# EAGLE board EEGFrontOnly (EAGLE 8.6.0), part 1 of 2
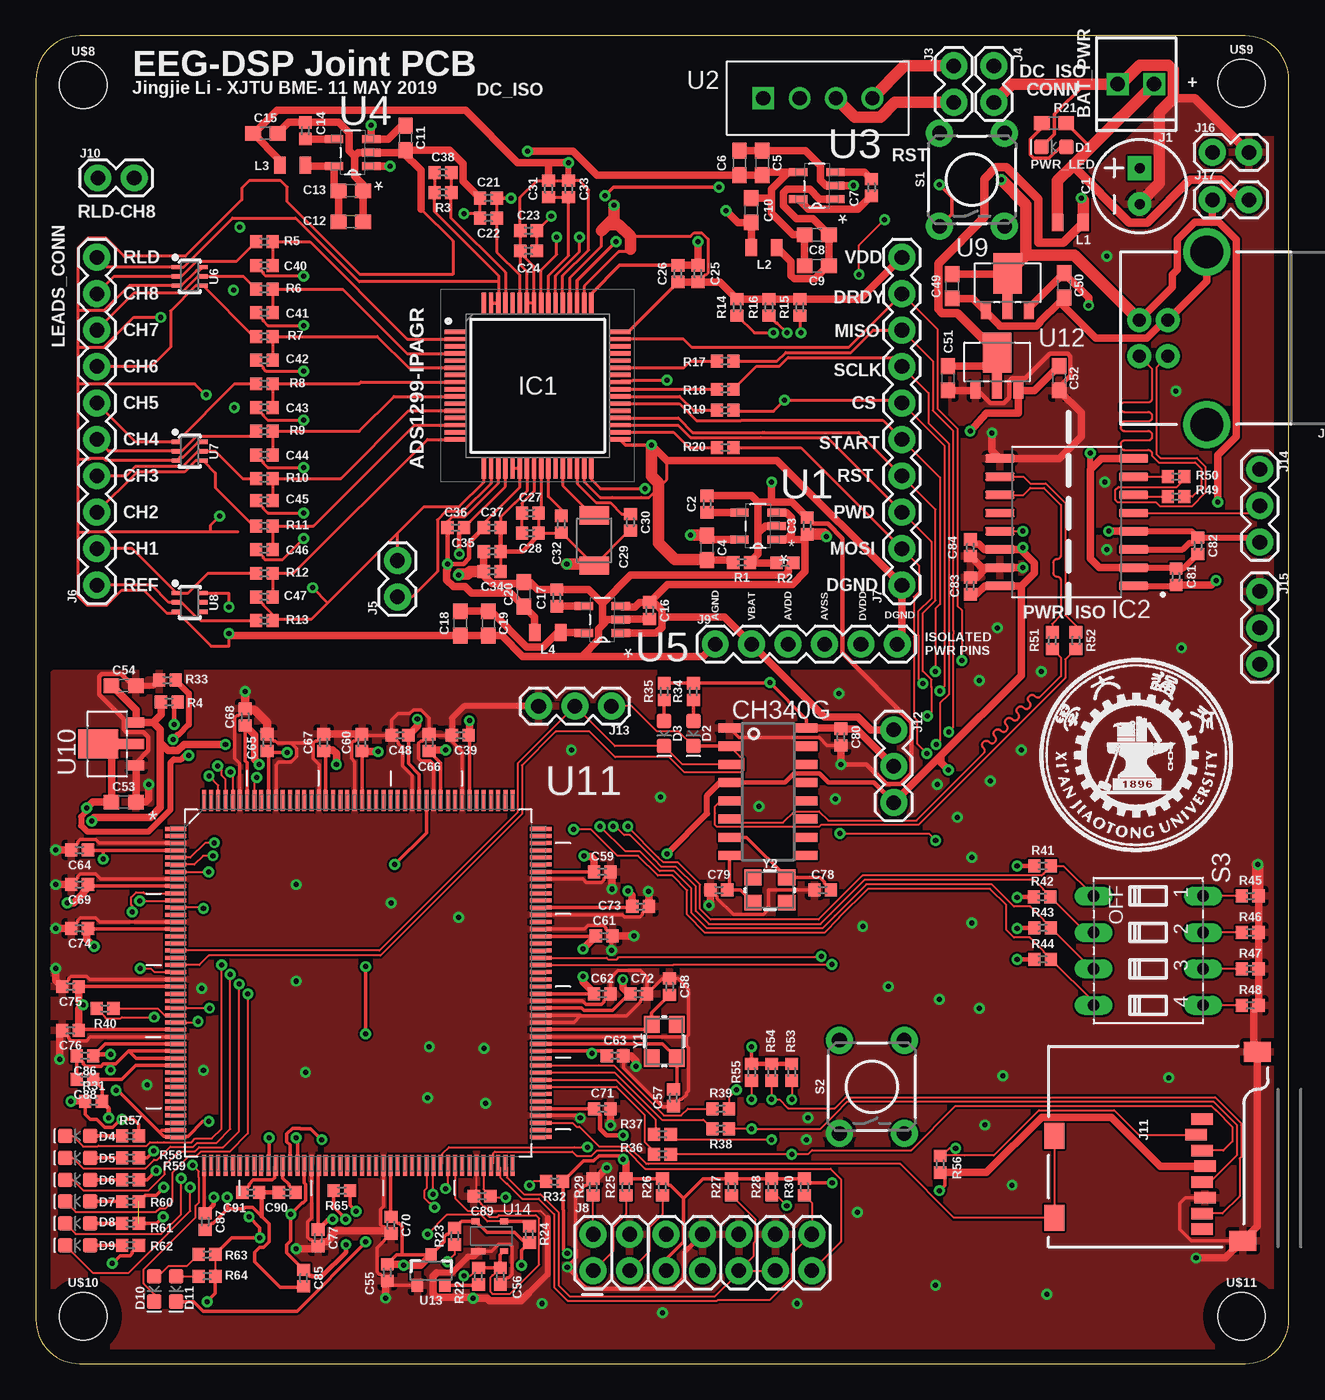
[diagram p4: board, top side]
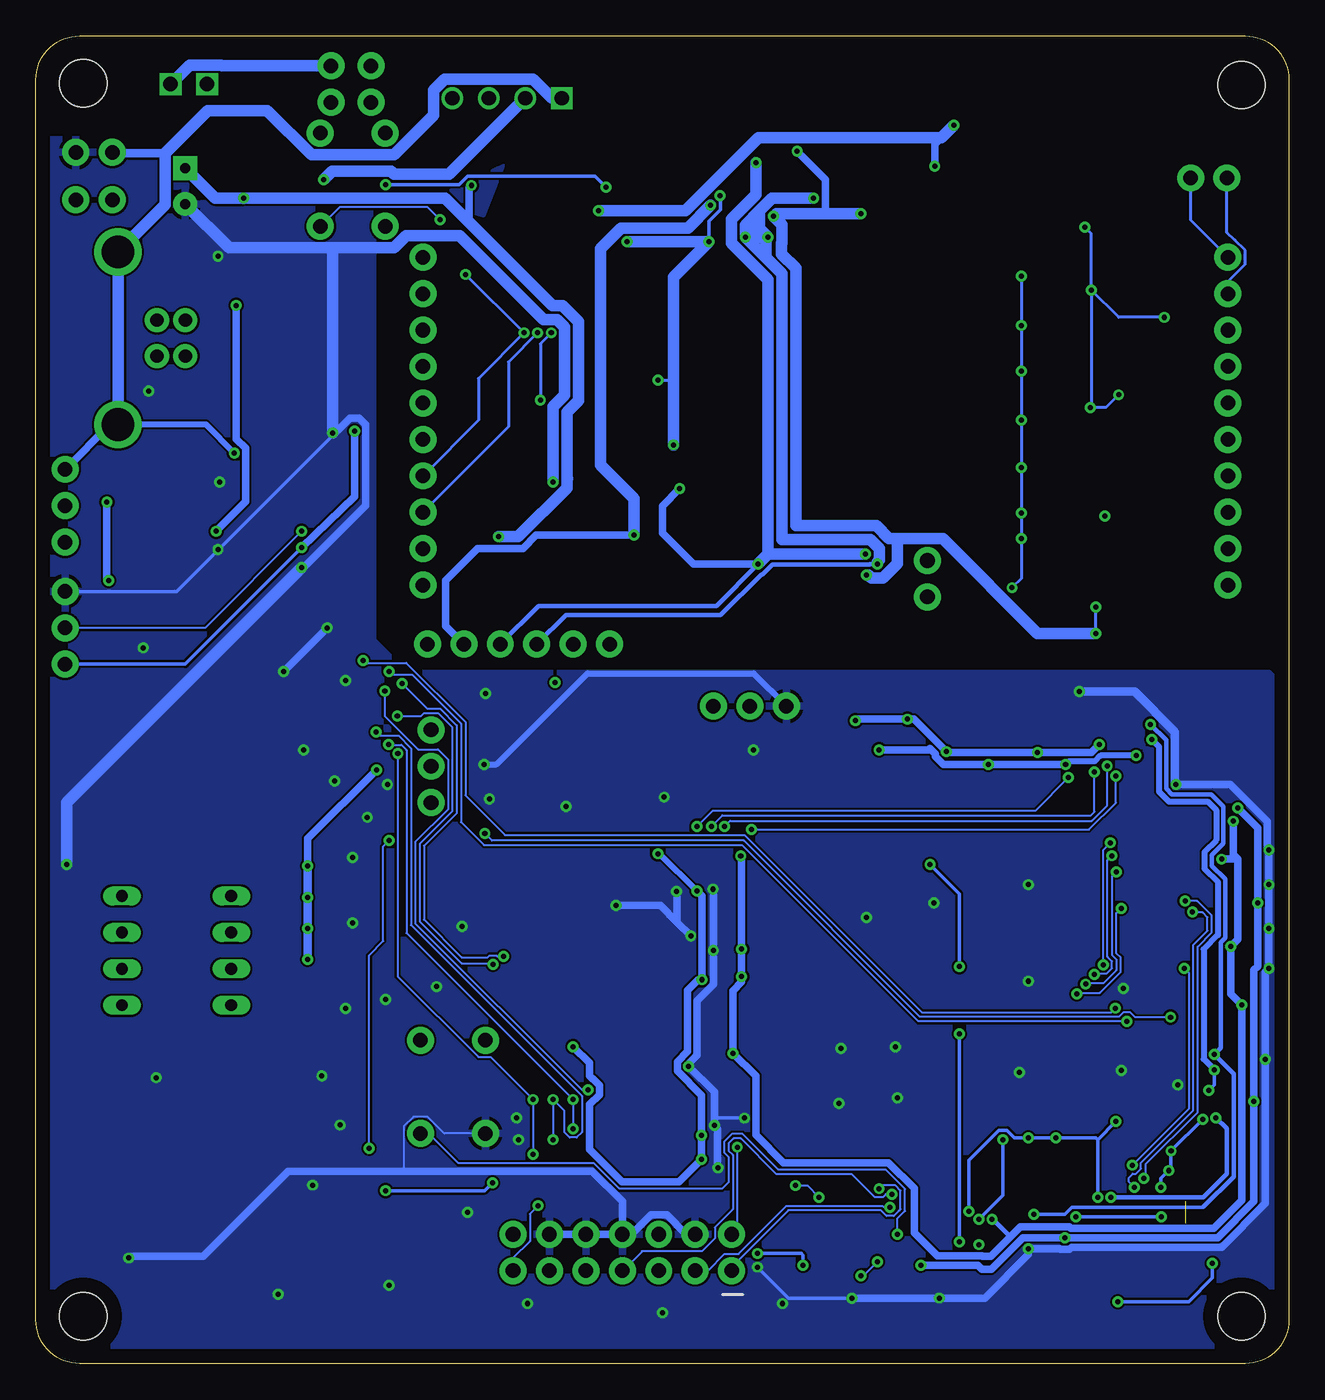
[diagram p5: board, bottom side, seen from below]

Size 87.38 x 92.58 mm. Coordinates in mm from the lower left corner, seen from the top.
Outline: 87.38,3.05 87.38,89.53 arc90 84.33,92.58 3.05,92.58 arc90 0,89.53 0,3.05 arc90 3.05,0 84.33,0 arc90 87.38,3.05
Copper layers (1*16): Top 0.035mm / dielectric 1.53mm / Bottom 0.035mm
Design rules "default *": minimum track width 6mil, minimum drill 0.35mm, track to track 6mil, track to pad 6mil, pad to pad 6mil, via to via 6mil, smd to smd 6mil, copper to edge 40mil, drill to drill 6mil, minimum pad ring 10mil, minimum via ring 8mil, stop-mask expansion 4mil, vias tented up to drill 0mil, thermal gap 10mil

## Footprints (pad centres in the part's own frame; a part is rotated, then mirrored left to right if it is on the bottom)
CPOL-RADIAL-2.5MM-6.5MM = drill 0.7 pad 1.651 square: 1 1.25,0 | drill 0.7 pad 1.651: 2 -1.25,0
0402 = smd 0.85 x 0.9: 1 -0.58,0; 2 0.58,0
0603 = smd 1.1 x 1: 1 -0.85,0; 2 0.85,0
1210 = smd 1.27 x 2.06: 1 -1.755,0; 2 1.755,0
LED-0603 = smd 1 x 1: A -0.877,0; C 0.877,0
QFP50P1200X1200X120-64N = smd 1.475 x 0.3: 1 -5.738,3.75; 2 -5.738,3.25; 3 -5.738,2.75; 4 -5.738,2.25; 5 -5.738,1.75; 6 -5.738,1.25; 7 -5.738,0.75; 8 -5.738,0.25; 9 -5.738,-0.25; 10 -5.738,-0.75; 11 -5.738,-1.25; 12 -5.738,-1.75; 13 -5.738,-2.25; 14 -5.738,-2.75; 15 -5.738,-3.25; 16 -5.738,-3.75; 33 5.738,-3.75; 34 5.738,-3.25; 35 5.738,-2.75; 36 5.738,-2.25; 37 5.738,-1.75; 38 5.738,-1.25; 39 5.738,-0.75; 40 5.738,-0.25; 41 5.738,0.25; 42 5.738,0.75; 43 5.738,1.25; 44 5.738,1.75; 45 5.738,2.25; 46 5.738,2.75; 47 5.738,3.25; 48 5.738,3.75 | smd 0.3 x 1.475: 17 -3.75,-5.738; 18 -3.25,-5.738; 19 -2.75,-5.738; 20 -2.25,-5.738; 21 -1.75,-5.738; 22 -1.25,-5.738; 23 -0.75,-5.738; 24 -0.25,-5.738; 25 0.25,-5.738; 26 0.75,-5.738; 27 1.25,-5.738; 28 1.75,-5.738; 29 2.25,-5.738; 30 2.75,-5.738; 31 3.25,-5.738; 32 3.75,-5.738; 49 3.75,5.738; 50 3.25,5.738; 51 2.75,5.738; 52 2.25,5.738; 53 1.75,5.738; 54 1.25,5.738; 55 0.75,5.738; 56 0.25,5.738; 57 -0.25,5.738; 58 -0.75,5.738; 59 -1.25,5.738; 60 -1.75,5.738; 61 -2.25,5.738; 62 -2.75,5.738; 63 -3.25,5.738; 64 -3.75,5.738
SOIC127P1032X265-16N = smd 2.05 x 0.6: 1 -4.655,4.445; 2 -4.655,3.175; 3 -4.655,1.905; 4 -4.655,0.635; 5 -4.655,-0.635; 6 -4.655,-1.905; 7 -4.655,-3.175; 8 -4.655,-4.445; 9 4.655,-4.445; 10 4.655,-3.175; 11 4.655,-1.905; 12 4.655,-0.635; 13 4.655,0.635; 14 4.655,1.905; 15 4.655,3.175; 16 4.655,4.445
1X02_2.54_SCREWTERM = drill 1.016 square: P1 2.54,0; P2 0,0
USB-B-PTH = drill 0.914 pad 1.676: D+ 4,1.25; D- 5.981,1.25; GND 4,-1.25; VBUS 5.981,-1.25 | drill 2.286: SHLD1 1.282,-6.02; SHLD2 1.282,6.02
1X02 = drill 1.016 pad 1.88: 1 0,0; 2 2.54,0
1X10 = drill 1.016 pad 1.88: 1 0,0; 2 2.54,0; 3 5.08,0; 4 7.62,0; 5 10.16,0; 6 12.7,0; 7 15.24,0; 8 17.78,0; 9 20.32,0; 10 22.86,0
2X7 = drill 1.016 pad 1.88: 1 0,0; 2 0,2.54; 3 2.54,0; 4 2.54,2.54; 5 5.08,0; 6 5.08,2.54; 7 7.62,0; 8 7.62,2.54; 9 10.16,0; 10 10.16,2.54; 11 12.7,0; 12 12.7,2.54; 13 15.24,0; 14 15.24,2.54
1X06 = drill 1.016 pad 1.88: 1 0,0; 2 2.54,0; 3 5.08,0; 4 7.62,0; 5 10.16,0; 6 12.7,0
MICRO-SD-SOCKET = smd 1.8 x 1.4: CD1 -2.05,0.4; CD2 -7.75,0.4 | smd 0.8 x 1.5: CS -7.84,10.3; DI -6.74,10.7; DO -2.34,10.7; GND -3.44,10.9; RSV1 -8.94,10.7; RSV2 -1.24,10.7; SCLK -4.54,10.7; VCC -5.64,10.9 | smd 1.4 x 1.9: GND1 -13.6,14.55; GND3 -0.45,13.55
1X03 = drill 1.016 pad 1.88: 1 0,0; 2 2.54,0; 3 5.08,0
0805 = smd 0.8 x 1.2: 1 -0.9,0; 2 0.9,0
TACTILE_SWITCH_PTH_6.0MM = drill 1.016 pad 1.88: 1 -3.251,2.261; 2 3.251,2.261; 3 -3.251,-2.261; 4 3.251,-2.261
DIP04S = drill 0.813 long: 1 -3.81,-3.81; 2 -1.27,-3.81; 3 1.27,-3.81; 4 3.81,-3.81; 5 3.81,3.81; 6 1.27,3.81; 7 -1.27,3.81; 8 -3.81,3.81
SOT95P280X145-5N = smd 1.27 x 0.559: 1 -1.295,0.94; 2 -1.295,0; 3 -1.295,-0.94; 4 1.295,-0.94; 5 1.295,0.94
DIP4 = drill 1 square: 1 0,0 | drill 1: 2 2.54,0; 3 5.08,0; 4 7.62,0
SC70-6 = smd 0.3 x 0.66: 1 -0.65,-0.92; 2 0,-0.92; 3 0.65,-0.92; 4 0.65,0.92; 5 0,0.92; 6 -0.65,0.92
SOT-89 = smd 0.7 x 1.1: 1 1.5,-2.385; 2 -1.5,-2.385 | smd 0.7 x 1.8: 3 0,-2.035 | smd 2 x 2.8: 4 0,0.265
QFP50P2600X2600X160-176N = smd 1.473 x 0.279: 1 -12.725,10.744; 2 -12.725,10.262; 3 -12.725,9.754; 4 -12.725,9.246; 5 -12.725,8.738; 6 -12.725,8.255; 7 -12.725,7.747; 8 -12.725,7.239; 9 -12.725,6.756; 10 -12.725,6.248; 11 -12.725,5.74; 12 -12.725,5.258; 13 -12.725,4.75; 14 -12.725,4.242; 15 -12.725,3.759; 16 -12.725,3.251; 17 -12.725,2.743; 18 -12.725,2.261; 19 -12.725,1.753; 20 -12.725,1.245; 21 -12.725,0.762; 22 -12.725,0.254; 23 -12.725,-0.254; 24 -12.725,-0.762; 25 -12.725,-1.245; 26 -12.725,-1.753; 27 -12.725,-2.261; 28 -12.725,-2.743; 29 -12.725,-3.251; 30 -12.725,-3.759; 31 -12.725,-4.242; 32 -12.725,-4.75; 33 -12.725,-5.258; 34 -12.725,-5.74; 35 -12.725,-6.248; 36 -12.725,-6.756; 37 -12.725,-7.239; 38 -12.725,-7.747; 39 -12.725,-8.255; 40 -12.725,-8.738; 41 -12.725,-9.246; 42 -12.725,-9.754; 43 -12.725,-10.262; 44 -12.725,-10.744; 89 12.725,-10.744; 90 12.725,-10.262; 91 12.725,-9.754; 92 12.725,-9.246; 93 12.725,-8.738; 94 12.725,-8.255; 95 12.725,-7.747; 96 12.725,-7.239; 97 12.725,-6.756; 98 12.725,-6.248; 99 12.725,-5.74; 100 12.725,-5.258; 101 12.725,-4.75; 102 12.725,-4.242; 103 12.725,-3.759; 104 12.725,-3.251; 105 12.725,-2.743; 106 12.725,-2.261; 107 12.725,-1.753; 108 12.725,-1.245; 109 12.725,-0.762; 110 12.725,-0.254; 111 12.725,0.254; 112 12.725,0.762; 113 12.725,1.245; 114 12.725,1.753; 115 12.725,2.261; 116 12.725,2.743; 117 12.725,3.251; 118 12.725,3.759; 119 12.725,4.242; 120 12.725,4.75; 121 12.725,5.258; 122 12.725,5.74; 123 12.725,6.248; 124 12.725,6.756; 125 12.725,7.239; 126 12.725,7.747; 127 12.725,8.255; 128 12.725,8.738; 129 12.725,9.246; 130 12.725,9.754; 131 12.725,10.262; 132 12.725,10.744 | smd 0.279 x 1.473: 45 -10.744,-12.725; 46 -10.262,-12.725; 47 -9.754,-12.725; 48 -9.246,-12.725; 49 -8.738,-12.725; 50 -8.255,-12.725; 51 -7.747,-12.725; 52 -7.239,-12.725; 53 -6.756,-12.725; 54 -6.248,-12.725; 55 -5.74,-12.725; 56 -5.258,-12.725; 57 -4.75,-12.725; 58 -4.242,-12.725; 59 -3.759,-12.725; 60 -3.251,-12.725; 61 -2.743,-12.725; 62 -2.261,-12.725; 63 -1.753,-12.725; 64 -1.245,-12.725; 65 -0.762,-12.725; 66 -0.254,-12.725; 67 0.254,-12.725; 68 0.762,-12.725; 69 1.245,-12.725; 70 1.753,-12.725; 71 2.261,-12.725; 72 2.743,-12.725; 73 3.251,-12.725; 74 3.759,-12.725; 75 4.242,-12.725; 76 4.75,-12.725; 77 5.258,-12.725; 78 5.74,-12.725; 79 6.248,-12.725; 80 6.756,-12.725; 81 7.239,-12.725; 82 7.747,-12.725; 83 8.255,-12.725; 84 8.738,-12.725; 85 9.246,-12.725; 86 9.754,-12.725; 87 10.262,-12.725; 88 10.744,-12.725; 133 10.744,12.725; 134 10.262,12.725; 135 9.754,12.725; 136 9.246,12.725; 137 8.738,12.725; 138 8.255,12.725; 139 7.747,12.725; 140 7.239,12.725; 141 6.756,12.725; 142 6.248,12.725; 143 5.74,12.725; 144 5.258,12.725; 145 4.75,12.725; 146 4.242,12.725; 147 3.759,12.725; 148 3.251,12.725; 149 2.743,12.725; 150 2.261,12.725; 151 1.753,12.725; 152 1.245,12.725; 153 0.762,12.725; 154 0.254,12.725; 155 -0.254,12.725; 156 -0.762,12.725; 157 -1.245,12.725; 158 -1.753,12.725; 159 -2.261,12.725; 160 -2.743,12.725; 161 -3.251,12.725; 162 -3.759,12.725; 163 -4.242,12.725; 164 -4.75,12.725; 165 -5.258,12.725; 166 -5.74,12.725; 167 -6.248,12.725; 168 -6.756,12.725; 169 -7.239,12.725; 170 -7.747,12.725; 171 -8.255,12.725; 172 -8.738,12.725; 173 -9.246,12.725; 174 -9.754,12.725; 175 -10.262,12.725; 176 -10.744,12.725
SOT23-3 = smd 0.8 x 0.9: 1 -0.95,-1; 2 0.95,-1; 3 0,1.1
SOT143 = smd 1 x 0.42: 1 -0.89,-1.045 | smd 0.56 x 0.41: 2 0.91,-1.04; 3 0.911,1.028; 4 -1.079,1.041
SOIC16 = smd 0.635 x 1.524: 1 -4.445,-2.695; 2 -3.175,-2.695; 3 -1.905,-2.695; 4 -0.635,-2.695; 5 0.635,-2.695; 6 1.905,-2.695; 7 3.175,-2.695; 8 4.445,-2.695; 9 4.445,2.695; 10 3.175,2.695; 11 1.905,2.695; 12 0.635,2.695; 13 -0.635,2.695; 14 -1.905,2.695; 15 -3.175,2.695; 16 -4.445,2.695
STAND-OFF = hole 3.302: 0,0
CRYSTAL-SMD-3.2X2.5MM = smd 1.2 x 1.1: 1 -1.175,-0.875; 2 1.175,-0.875; 3 1.175,0.875; 4 -1.175,0.875

## Placement (x,y rotation side)
C1  100uF  [CPOL-RADIAL-2.5MM-6.5MM]  76.96,82.11 90 top
C2  10nF  [0402]  46.8,59.94 90 top
C3  1.0uF  [0402]  53.78,58.41 90 top
C4  2.2uF  [0603]  46.8,56.89 270 top
C5  10uF  [0603]  50.65,83.72 270 top
C6  1.0uF  [0603]  49.06,83.72 270 top
C7  1.0uF  [0402]  58.27,82.01 90 top
C8  10uF  [0603]  54.46,78.7 180 top
C9  1.0uF  [0603]  54.46,76.55 180 top
C10  10uF  [0603]  49.88,80.42 90 top
C11  2.2uF  [0603]  25.78,85.46 270 top
C12  2.2uF  [0603]  21.97,79.62 0 top
C13  10uF  [0603]  21.97,81.78 0 top
C14  10nF  [0402]  18.8,85.97 90 top
C15  10uF  [0603]  16,85.78 0 top
C16  1.0uF  [0402]  42.8,52.51 270 top
C17  1.0uF  [0402]  36.32,53.4 90 top
C18  10uF  [0603]  29.59,51.62 270 top
C19  2.2uF  [0603]  31.56,51.62 270 top
C20  10uF  [0603]  34.04,53.65 90 top
C21  1.0uF  [0402]  31.56,81.27 180 top
C22  0.1uF  [0402]  31.56,79.87 180 top
C23  1.0uF  [0402]  34.35,78.99 0 top
C24  0.1uF  [0402]  34.35,77.59 0 top
C25  1.0uF  [0402]  46.16,76 90 top
C26  0.1uF  [0402]  44.77,76 90 top
C27  0.1uF  [0402]  34.48,59.3 180 top
C28  10uF  [0402]  34.48,57.9 180 top
C29  100uF  [1210]  38.93,57.4 270 top
C30  1.0uF  [0402]  41.47,58.67 270 top
C31  1.0uF  [0402]  35.75,81.91 90 top
C32  1.0uF  [0402]  36.64,58.54 90 top
C33  0.1uF  [0402]  37.15,81.91 90 top
C34  1.0uF  [0402]  31.81,55.24 180 top
C35  0.1uF  [0402]  31.81,56.63 180 top
C36  NI  [0402]  29.27,58.28 0 top
C37  NI  [0402]  31.81,58.28 0 top
C38  1.5nF  [0402]  28.38,83.05 0 top
C39  0.1uF  [0402]  29.59,43.82 180 top
C40  4.7nF  [0402]  15.94,76.57 180 top
C41  4.7nF  [0402]  15.94,73.27 180 top
C42  4.7nF  [0402]  15.94,69.97 180 top
C43  4.7nF  [0402]  15.94,66.67 180 top
C44  4.7nF  [0402]  15.94,63.36 180 top
C45  4.7nF  [0402]  15.94,60.19 180 top
C46  4.7nF  [0402]  15.94,56.76 180 top
C47  4.7nF  [0402]  15.94,53.46 180 top
C48  0.1uF  [0402]  25.4,43.82 180 top
C49  10uF  [0603]  63.88,75.12 270 top
C50  10uF  [0603]  71.69,75.18 270 top
C51  10uF  [0603]  63.6,68.71 270 top
C52  10uF  [0603]  71.34,68.71 270 top
C53  10uF  [0603]  6.13,39.15 0 top
C54  10uF  [0603]  6.13,47.28 0 top
C55  0.1uF  [0402]  24.51,6.35 270 top
C56  0.1uF  [0402]  32.39,6.1 270 top
C57  22pF  [0402]  44.45,18.54 90 top
C58  22pF  [0402]  44.2,26.29 270 top
C59  0.1uF  [0402]  39.5,34.29 0 top
C60  0.1uF  [0402]  22.73,43.31 90 top
C61  0.1uF  [0402]  39.62,29.81 0 top
C62  0.1uF  [0402]  39.5,25.78 0 top
C63  0.1uF  [0402]  40.39,21.46 0 top
C64  0.1uF  [0402]  3.05,35.81 180 top
C65  0.1uF  [0402]  16.13,43.31 90 top
C66  0.1uF  [0402]  27.43,43.31 90 top
C67  0.1uF  [0402]  20.07,43.31 90 top
C68  0.1uF  [0402]  14.61,45.09 90 top
C69  0.1uF  [0402]  3.05,33.4 180 top
C70  0.1uF  [0402]  24.76,9.65 270 top
C71  0.1uF  [0402]  39.5,17.78 0 top
C72  0.1uF  [0402]  42.04,25.78 0 top
C73  0.1uF  [0402]  42.16,31.88 0 top
C74  0.1uF  [0402]  3.05,30.35 180 top
C75  0.1uF  [0402]  2.41,26.29 180 top
C76  0.1uF  [0402]  2.41,23.24 180 top
C77  0.1uF  [0402]  19.68,8.76 270 top
C78  22pF  [0402]  54.86,33.02 0 top
C79  22pF  [0402]  47.62,33.02 0 top
C80  0.1uF  [0402]  56.13,43.69 270 top
C81  0.1uF  [0402]  79.5,54.86 90 top
C82  0.1uF  [0402]  81.03,57.02 270 top
C83  0.1uF  [0402]  65.15,54.23 90 top
C84  0.1uF  [0402]  65.15,56.9 270 top
C85  0.1uF  [0402]  18.67,5.97 270 top
C86  0.1uF  [0402]  3.43,21.46 180 top
C87  0.1uF  [0402]  11.81,9.91 270 top
C88  0.1uF  [0402]  3.43,19.81 180 top
C89  0.1uF  [0402]  31.11,11.68 180 top
C90  2.2uF  [0402]  17.53,11.94 180 top
C91  2.2uF  [0402]  14.99,11.94 0 top
D1  GREEN  [LED-0603]  70.99,84.84 180 top
D2  RED  [LED-0603]  45.85,43.94 270 top
D3  RED  [LED-0603]  43.82,43.94 270 top
D4  RED  [LED-0603]  2.92,15.88 180 top
D5  RED  [LED-0603]  2.92,14.35 180 top
D6  RED  [LED-0603]  2.92,12.83 180 top
D7  RED  [LED-0603]  2.92,11.3 180 top
D8  RED  [LED-0603]  2.92,9.78 180 top
D9  RED  [LED-0603]  2.92,8.26 180 top
D10  RED  [LED-0603]  8.26,5.21 270 top
D11  RED  [LED-0603]  9.78,5.21 270 top
IC1  ADS1299-X  [QFP50P1200X1200X120-64N]  34.99,68.19 0 top
IC2  ADUM4160BRWZ  [SOIC127P1032X265-16N]  71.88,58.67 180 top
J1  [1X02_2.54_SCREWTERM]  77.98,89.22 180 top
J2  USB_B_PTH  [USB-B-PTH]  82.93,71.5 180 top
J3  [1X02]  64.01,90.49 270 top
J4  [1X02]  66.8,90.49 270 top
J5  [1X02]  25.21,53.46 90 top
J6  [1X10]  4.25,54.28 90 top
J7  [1X10]  60.39,54.28 90 top
J8  JTAG  [2X7]  38.86,6.48 0 top
J9  [1X06]  47.37,50.17 0 top
J10  [1X02]  4.32,82.68 0 top
J11  MICRO-SD_CARD_SOCKET  [MICRO-SD-SOCKET]  70.61,8.13 270 top
J12  455-1750-1-ND  [1X03]  59.82,44.2 270 top
J13  455-1750-1-ND  [1X03]  40.13,45.85 180 top
J14  455-1750-1-ND  [1X03]  85.34,62.36 270 top
J15  455-1750-1-ND  [1X03]  85.34,53.85 270 top
J16  [1X02]  82.04,84.45 0 top
J17  [1X02]  82.04,81.15 0 top
L1  3.3µH/±20%/450mA  [0805]  72.14,79.57 0 top
L2  3.3µH/±20%/450mA  [0805]  50.77,77.81 180 top
L3  3.3µH/±20%/450mA  [0805]  17.91,83.56 180 top
L4  3.3µH/±20%/450mA  [0805]  35.69,50.98 180 top
R1  0  [0402]  49.21,55.87 180 top
R2  0  [0402]  52.23,55.84 0 top
R3  1M  [0402]  28.38,81.65 180 top
R4  0OHM  [0402]  9.3,46.13 0 top
R5  4.99K  [0402]  15.94,78.22 0 top
R6  4.99K  [0402]  15.94,74.92 0 top
R7  4.99K  [0402]  15.94,71.62 0 top
R8  4.99K  [0402]  15.94,68.32 0 top
R9  4.99K  [0402]  15.94,65.02 0 top
R10  4.99K  [0402]  15.94,61.71 0 top
R11  4.99K  [0402]  15.94,58.41 0 top
R12  4.99K  [0402]  15.94,55.11 0 top
R13  4.99K  [0402]  15.94,51.81 0 top
R14  10k  [0402]  48.9,73.65 90 top
R15  10k  [0402]  53.28,73.65 90 top
R16  10k  [0402]  51.12,73.65 90 top
R17  0OHM  [0402]  48.07,69.91 0 top
R18  0OHM  [0402]  48.07,67.94 0 top
R19  0OHM  [0402]  48.07,66.48 0 top
R20  0OHM  [0402]  48.07,63.87 0 top
R21  2.2k  [0603]  70.99,86.49 0 top
R22  1k  [0402]  30.86,6.1 90 top
R23  10k  [0402]  29.21,8.89 90 top
R24  10k  [0402]  34.42,9.02 270 top
R25  10k  [0402]  41.15,12.32 90 top
R26  10k  [0402]  43.69,12.32 90 top
R27  10k  [0402]  48.51,12.32 90 top
R28  10k  [0402]  51.31,12.32 90 top
R29  10k  [0402]  38.86,12.32 270 top
R30  10k  [0402]  53.59,12.32 90 top
R31  0OHM  [0402]  4.03,18.29 0 top
R32  0OHM  [0402]  36.16,12.7 180 top
R33  0OHM  [0402]  9.18,47.66 0 top
R34  4.7k  [0402]  45.85,46.86 90 top
R35  4.7k  [0402]  43.82,46.86 90 top
R36  22  [0402]  43.69,14.61 0 top
R37  22  [0402]  43.69,16 0 top
R38  22  [0402]  47.75,16.38 0 top
R39  22  [0402]  47.75,17.78 0 top
R40  22  [0402]  4.83,24.77 180 top
R41  4.7k  [0402]  70.2,34.7 0 top
R42  4.7k  [0402]  70.17,32.54 0 top
R43  4.7k  [0402]  70.2,30.38 0 top
R44  4.7k  [0402]  70.2,28.19 0 top
R45  1k  [0402]  84.68,32.61 0 top
R46  1k  [0402]  84.68,30.07 0 top
R47  1k  [0402]  84.68,27.53 0 top
R48  1k  [0402]  84.68,24.99 0 top
R49  22  [0402]  79.5,60.45 180 top
R50  22  [0402]  79.5,61.85 180 top
R51  22  [0402]  70.87,50.42 270 top
R52  22  [0402]  72.52,50.42 270 top
R53  10k  [0402]  52.71,20.32 90 top
R54  10k  [0402]  51.31,20.32 90 top
R55  10k  [0402]  49.91,20.32 90 top
R56  10k  [0402]  63.06,13.91 270 top
R57  1k  [0402]  6.6,15.88 0 top
R58  1k  [0402]  6.6,14.35 0 top
R59  1k  [0402]  6.6,12.83 0 top
R60  1k  [0402]  6.6,11.3 0 top
R61  1k  [0402]  6.6,9.78 0 top
R62  1k  [0402]  6.6,8.26 0 top
R63  1k  [0402]  11.94,7.62 0 top
R64  1k  [0402]  11.94,6.1 0 top
R65  22k  [0402]  21.34,12.06 180 top
S1  MOMENTARY-SWITCH-SPST-PTH-6.0MM  [TACTILE_SWITCH_PTH_6.0MM]  65.28,82.55 90 top
S2  MOMENTARY-SWITCH-SPST-PTH-6.0MM  [TACTILE_SWITCH_PTH_6.0MM]  58.29,19.3 90 top
S3  [DIP04S]  77.57,28.8 270 top
U1  LP2985-33DBVT  [SOT95P280X145-5N]  50.36,58.41 180 top
U2  B0505S-1WB0505S-1W  [DIP4]  50.71,88.24 0 top
U3  TPS60403DBVT  [SOT95P280X145-5N]  54.46,82.13 180 top
U4  TPS73225DBVR  [SOT95P280X145-5N]  22.1,84.45 180 top
U5  TPS73225DBVR  [SOT95P280X145-5N]  39.5,51.87 180 top
U6  TPD4E1B06DCKR  [SC70-6]  10.73,75.81 270 top
U7  TPD4E1B06DCKR  [SC70-6]  10.73,63.62 270 top
U8  TPD4E1B06DCKR  [SC70-6]  10.73,53.08 270 top
U9  HT7333  [SOT-89]  67.75,75.76 0 top
U10  HT7318  [SOT-89]  4.61,43.21 90 top
U11  TMS320F28335PGFA  [QFP50P2600X2600X160-176N]  22.48,26.54 0 top
U12  HT7333  [SOT-89]  67.02,70.23 0 top
U13  2.93V  [SOT23-3]  27.56,6.48 0 top
U14  MAX811-812  [SOT143]  31.75,8.89 0 top
U$3  CH340G  [SOIC16]  51.05,39.88 270 top
U$7  [XJTULOGO]  69.98,35.69 0 top
U$8  [STAND-OFF]  3.3,89.15 0 top
U$9  [STAND-OFF]  84.07,89.28 0 top
U$10  [STAND-OFF]  3.3,3.3 0 top
U$11  [STAND-OFF]  84.07,3.3 0 top
Y1  30MHz  [CRYSTAL-SMD-3.2X2.5MM]  43.82,22.48 90 top
Y2  12MHz  [CRYSTAL-SMD-3.2X2.5MM]  51.18,33.02 0 top